# EAGLE design tweeq-Stamp_I2C_Temp_TMP102 (EAGLE 7.2.0)
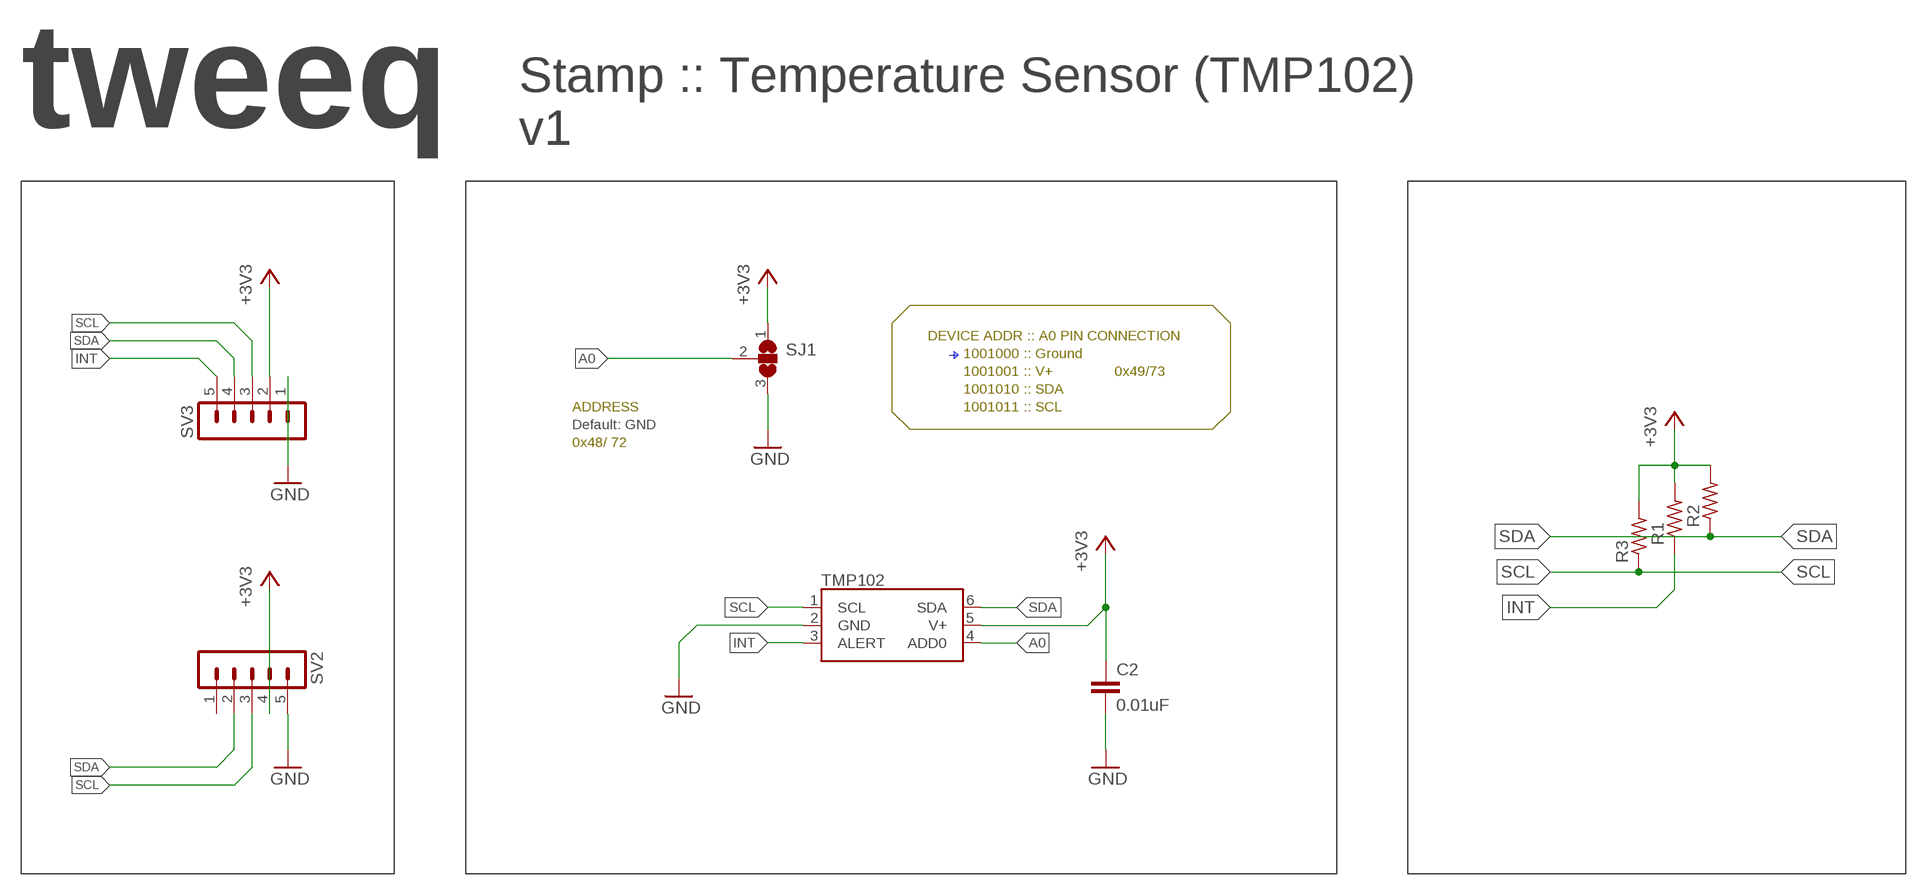
[diagram p0: schematic, sheet 1]

## Parts
C2  0.01uF  C-EUC0402K  [C0402K]
R1  R-US_R0402  [R0402]
R2  R-US_R0402  [R0402]
R3  R-US_R0402  [R0402]
SJ1  JUMPER_SJ2WS  [JUMPER_SJ_S]
SV2  M05-1STAMP  [1X05-1.5MM-STAMP]
SV3  M05-1STAMP  [1X05-1.5MM-STAMP]
TMP102  TMP102/SOT563  [SOT563]

## Nets
+3V3: C2.1 R1.2 R2.2 R3.2 SJ1.1 SV2.4 SV3.2 TMP102.5(V+)
A0: SJ1.2 TMP102.4(ADD0)
GND: C2.2 SJ1.3 SV2.5 SV3.1 TMP102.2(GND)
INT: R1.1 SV3.5 TMP102.3(ALERT)
SCL: R3.1 SV2.3 SV3.3 TMP102.1(SCL)
SDA: R2.1 SV2.2 SV3.4 TMP102.6(SDA)
Unconnected: SV2.1

## Notes on the sheet
- tweeq
- Stamp :: Temperature Sensor (TMP102)
  v1
- DEVICE ADDR :: A0 PIN CONNECTION
- 1001000 :: Ground
- 1001001 :: V+ | 0x49/73
- 1001010 :: SDA
- ADDRESS | 1001011 :: SCL
- Default: GND
- 0x48/ 72

## Library data of the parts
C2 = AISCube:C-EU: CAPACITOR, European symbol
R1-R3 = AISCube:R-US_: RESISTOR, American symbol
SJ1 = AISCube:JUMPER_SJ2W: SMD solder JUMPER
SV2 SV3 = AISCube:M05-1: PIN HEADER Standard 0.1" header pin 5 pins - 1 way
TMP102 = AISCube:TMP102: TI TMP102/10x Low Power Digital Temperature Sensor With SMBus™/Two-Wire Serial Interface in SOT563 The TMP102 is a two-wire, serial output temperature sensor available in a tiny SOT563 package. Requiring no external components, the TMP102 is capable of reading temperatures to a resolution of 0.0625°C.

## Board
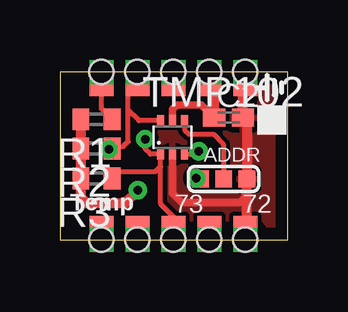
[diagram p1: board, top side]
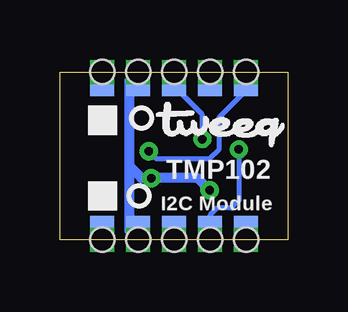
[diagram p2: board, bottom side, seen from below]

Size 9.5 x 7 mm. Coordinates in mm from the lower left corner, seen from the top.
Outline: 9.5,7 0,7 0,0 9.5,0 9.5,7
Copper layers (1*16): Top 0.0356mm / dielectric 1.5011mm / Bottom 0.0356mm
Design rules "AISCube": minimum track width 7mil, minimum drill 14mil, track to track 7mil, track to pad 7mil, pad to pad 7mil, via to via 7mil, smd to smd 0mil, copper to edge 20mil, drill to drill 8mil, minimum pad ring 10mil, minimum via ring 8mil, stop-mask expansion 4mil, vias tented up to drill 32mil, thermal gap 10mil

### Footprints (pad centres in the part's own frame; a part is rotated, then mirrored left to right if it is on the bottom)
C0402K = smd 0.925 x 0.74: 1 -0.6,0; 2 0.6,0
R0402 = smd 0.7 x 0.9: 1 -0.65,0; 2 0.65,0
JUMPER_SJ_S = smd 0.7 x 0.7: 1 -0.974,-0.02; 2 0,-0.02; 3 0.974,-0.02
1X05-1.5MM-STAMP = drill 0.5 pad 1 square: 1 -3,0; 2 -1.5,0; 3 0,0; 4 1.5,0; 5 3,0 | smd 1 x 0.6: P$1 -3,0.7; P$2 -1.5,0.7; P$3 0,0.7; P$4 1.5,0.7; P$5 3,0.7 | smd 1 x 0.6 bottom: P$6 -3,0.7; P$7 -1.5,0.7; P$8 0,0.7; P$9 1.5,0.7; P$10 3,0.7 | hole 1: -3,0; -1.5,0; 0,0; 1.5,0; 3,0
SOT563 = smd 0.3 x 0.45: 1 -0.5,-0.7; 2 0,-0.7; 3 0.5,-0.7; 4 0.5,0.7; 5 0,0.7; 6 -0.5,0.7

### Placement (x,y rotation side)
C2  7.04,5.1 0 top
R1  1.52,5.03 180 top
R2  1.52,3.81 180 top
R3  1.52,2.56 180 top
SJ1  6.83,2.56 0 top
SV2  4.74,0 0 top
SV3  4.74,7 180 top
TMP102  4.7,4.27 0 top
U$1  [TWEEQ-LOGO-S]  5.49,3.86 0 bottom

### Tracks (layer width: path | path; a pad name or v marks a point on that pad's centre or on a via)
+3V3  (via drill 0.36)
  Top 0.305: TMP102.5 4.7,5.44 4.88,5.62 5.91,5.62 C2.1 | SJ1.1 5.73,2.54 v5.69,2.57
  Top 0.406: R1.2 R2.2 R3.2 0.87,1.78 1.12,1.53 2.72,1.53 v3.25,2.06 | SV3.2 6.44,6.8 C2.1
  Bottom 0.406: 6.6,3.08 6.1,2.57 v5.69,2.57 3.76,2.57 v3.25,2.06 | 6.6,3.08 6.6,6.63 SV3.2 | SV2.4 6.6,0.37 6.6,3.08
A0
  Top 0.203: TMP102.4 5.2,4.59 5.38,4.4 6.4,4.4 6.83,3.97 SJ1.2
GND
  Top 0.305: TMP102.2 4.7,1.94 5.08,1.56 7.52,1.56 7.82,1.86 7.82,2.52 SJ1.3
  Top 0.406: SV3.1 7.64,6.9 C2.2 7.81,5.13 SJ1.3 7.81,0.07 SV2.5
  pour Bottom: 0.19,6.85 9.34,6.85 9.34,0.21 0.19,0.21
  pour Top: 0.19,6.85 9.34,6.85 9.34,0.21 0.19,0.21
INT  (via drill 0.36)
  Top 0.203: TMP102.3 5.67,3.57 v5.79,3.69 | SV3.5 1.74,5.46 R1.1 2.13,5.07 2.13,5.32
  Bottom 0.203: v5.79,3.69 5.49,3.38 3.25,3.38 2.85,3.79 2.85,5.11 1.74,6.22 SV3.5
SCL  (via drill 0.36)
  Top 0.203: v3.56,4.2 3.56,3.79 3.78,3.57 TMP102.1 4.2,3.06 | 4.74,0.45 SV2.3 4.74,0.95 4.2,1.49 4.2,3.06 | R3.1 2.17,2.59 2.44,2.85 4,2.85 4.2,3.06
  Bottom 0.203: v3.56,4.2 3.56,5.21 4.37,6.03 4.37,6.63 SV3.3
SDA  (via drill 0.36)
  Top 0.203: 2.85,5.42 2.85,4.1 2.64,3.89 2.27,3.89 R2.1 2.07,3.81 v2.03,3.77 | 2.85,5.42 2.85,6.61 SV3.4 | TMP102.6 3.29,4.97 2.85,5.42
  Bottom 0.203: v2.03,3.77 2.03,1.63 2.34,1.32 2.95,1.32 3.23,1.03 SV2.2

### Text on the board
tPlace: ADDR | Temp | 73 | 72
bPlace: TMP102 | I2C Module
tNames: 6V-9V DC | ON
bNames: Breadboard | V-Reg | Module